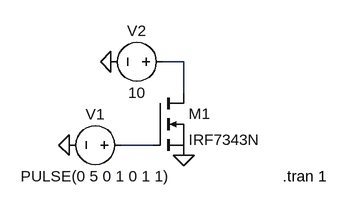
[diagram p0: schematic nmos2.asc]
nmos2.asc, the LTspice schematic file:
Version 4.1
SHEET 1 880 680
WIRE 224 80 192 80
WIRE 224 128 224 80
WIRE 176 208 128 208
FLAG 48 208 0
FLAG 112 80 0
FLAG 224 224 0
SYMBOL nmos 176 128 R0
SYMATTR InstName M1
SYMATTR Value IRF7343N
SYMBOL voltage 144 208 R90
WINDOW 0 -32 56 VBottom 2
WINDOW 3 32 56 VTop 2
WINDOW 123 0 0 Left 0
WINDOW 39 0 0 Left 0
SYMATTR InstName V1
SYMATTR Value PULSE(0 5 0 1 0 1 1)
SYMBOL voltage 208 80 R90
WINDOW 0 -32 56 VBottom 2
WINDOW 3 32 56 VTop 2
WINDOW 123 0 0 Left 0
WINDOW 39 0 0 Left 0
SYMATTR InstName V2
SYMATTR Value 10
TEXT 376 256 Left 2 !.tran 1

The netlist it stands for:
* nmos2.asc
M1 N001 N002 0 0 IRF7343N
V1 N002 0 PULSE(0 5 0 1 0 1 1)
V2 N001 0 10
.model NMOS NMOS
.model PMOS PMOS
.lib standard.mos
.tran 1
.backanno
.end